# Altium project Rev5_FE_Test_Latched.PrjPCB
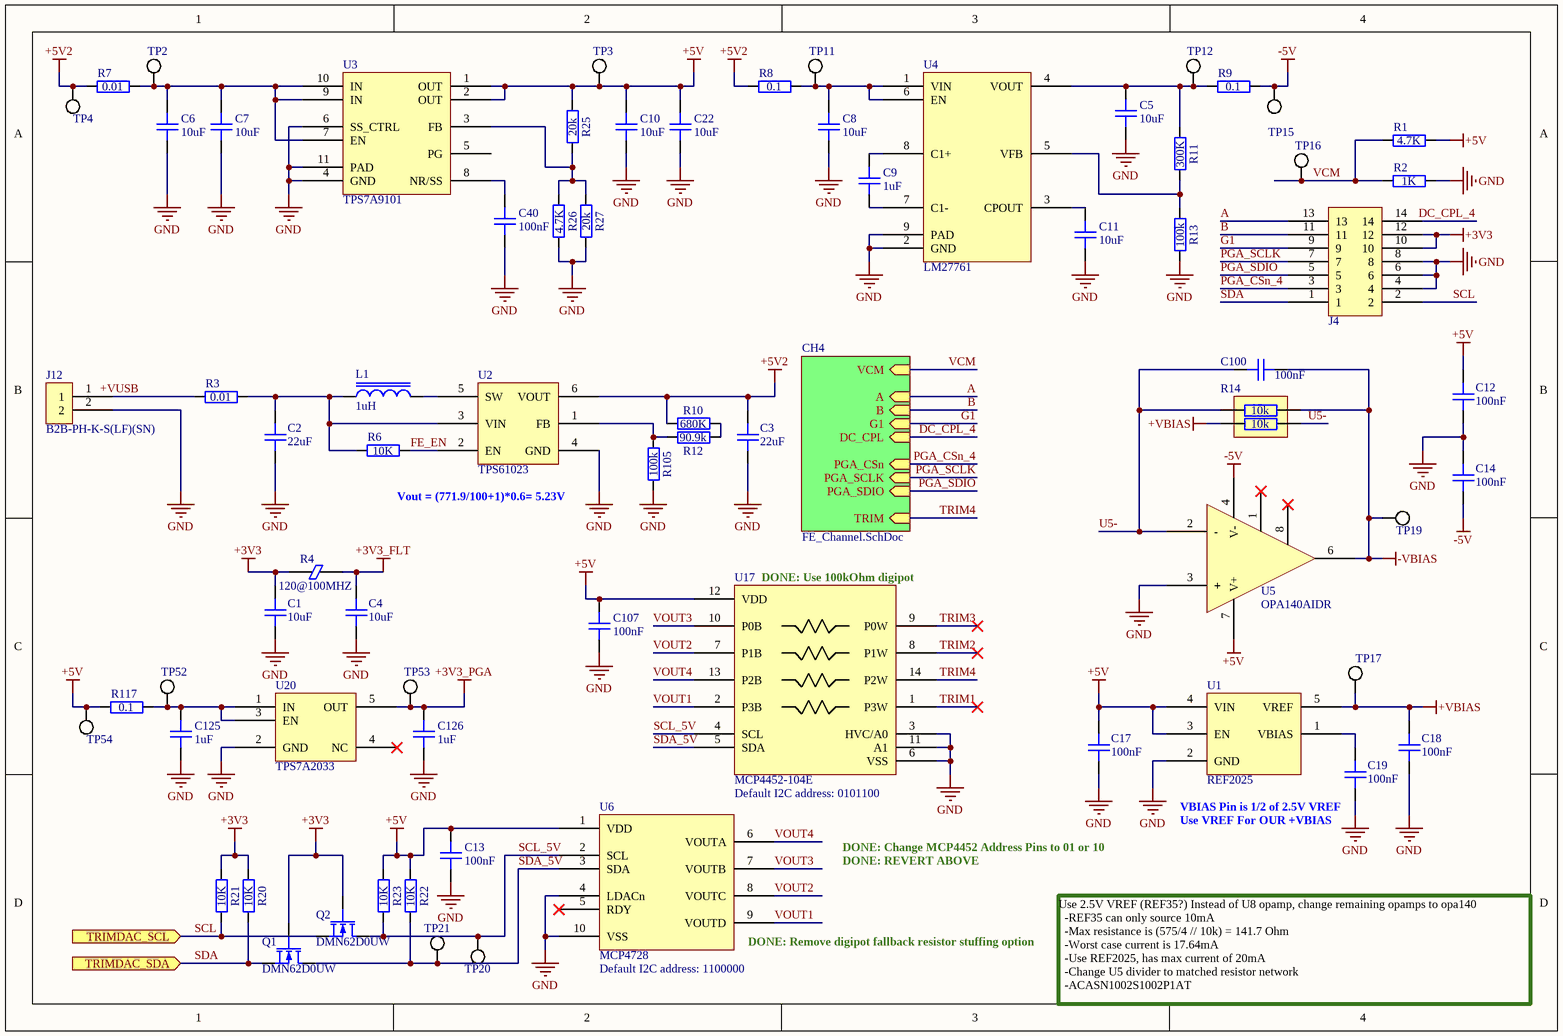
[diagram p0: FE.SchDoc]
Title: ThunderScope 1000E; Template Source URL: http://www.pcisig.com; Template Source Revision Date: R2.0, April 11, 2007; Template Source Organization: PCI-SIG; Template Source Document: Outline:PCI_Express_CEM_r2.0.pdf  Pinout:PCI_Express_CEM_r2.0.pdf; Template Revision Date: Oct 29, 2010; Template Notes: - Nominal values used, dimensions in mm  - The mounting holes and keep-out areas around them are only required when the I/O bracket is mounted on the card directly  - Component height rule and clearance rule derived from PCI_Express_CEM_r2.0.pdf, Page 84.  - Stackup is not specified in PCI_Express_CEM_r2.0.pdf, nor implemented in this template.
2 sheets, 161 parts. Net scope: hierarchical (ports join the sheet entries above them; power ports are global).
Board file: Rev5_FE_Test_Latched.PCBDOC
Sheets:
  FE.SchDoc
    CH4 = FE_Channel.SchDoc

## Sheet FE.SchDoc: ThunderScope 1000E
size A4; Revision: 1

### Parts
C1  10uF  [GEN_C_0603]
C2  22uF  [GEN_C_0805]
C3  22uF  [GEN_C_0805]
C4  10uF  [GEN_C_0603]
C5  10uF  [GEN_C_0603]
C6  10uF  [GEN_C_0603]
C7  10uF  [GEN_C_0603]
C8  10uF  [GEN_C_0603]
C9  1uF  [GEN_C_0402]
C10  10uF  [GEN_C_0603]
C11  10uF  [GEN_C_0603]
C12  100nF  [GEN_C_0402]
C13  100nF  [GEN_C_0402]
C14  100nF  [GEN_C_0402]
C17  100nF  [GEN_C_0402]
C18  100nF  [GEN_C_0402]
C19  100nF  [GEN_C_0402]
C22  10uF  [GEN_C_0603]
C40  100nF  [GEN_C_0402]
C100  100nF  [GEN_C_0402]
C107  100nF  [GEN_C_0402]
C125  1uF  [GEN_C_0402]
C126  1uF  [GEN_C_0402]
J4  2.54mm 2X7 Pin TH  [GEN_2.54mm_2X7_Pin_TH_RA]  (value not drawn)
J12  B2B-PH-K-S(LF)(SN)  [JST_B2B-PH-K-S(LF)(SN)]
L1  1uH  [GEN_L_1210]
Q1  DMN62D0UW  [GEN_SOT_323]
Q2  DMN62D0UW  [GEN_SOT_323]
R1  4.7K  [GEN_R_0402]
R2  1K  [GEN_R_0402]
R3  0.01  [GEN_R_0603]
R4  120@100MHZ  [GEN_R_0402]
R6  10K  [GEN_R_0402]
R7  0.01  [GEN_R_0603]
R8  0.1  [GEN_R_0402]
R9  0.1  [GEN_R_0402]
R10  680K  [GEN_R_0402]
R11  300K  [GEN_R_0402]
R12  90.9k  [GEN_R_0402]
R13  100k  [GEN_R_0402]
R14  10K  [GEN_R_2ARRAY_0606]  (value not drawn)
R20  10K  [GEN_R_0402]
R21  10K  [GEN_R_0402]
R22  10K  [GEN_R_0402]
R23  10K  [GEN_R_0402]
R25  20k  [GEN_R_0402]
R26  4.7K  [GEN_R_0402]
R27  20k  [GEN_R_0402]
R105  100k  [GEN_R_0402]
R117  0.1  [GEN_R_0402]
TP2  PCB  [GEN_TP_PCB]  (value not drawn)  (no BOM)
TP3  PCB  [GEN_TP_PCB]  (value not drawn)  (no BOM)
TP4  PCB  [GEN_TP_PCB]  (value not drawn)  (no BOM)
TP11  PCB  [GEN_TP_PCB]  (value not drawn)  (no BOM)
TP12  PCB  [GEN_TP_PCB]  (value not drawn)  (no BOM)
TP15  PCB  [GEN_TP_PCB]  (value not drawn)  (no BOM)
TP16  PCB  [GEN_TP_PCB]  (value not drawn)  (no BOM)
TP17  PCB  [GEN_TP_PCB]  (value not drawn)  (no BOM)
TP19  PCB  [GEN_TP_PCB]  (value not drawn)  (no BOM)
TP20  PCB  [GEN_TP_PCB]  (value not drawn)  (no BOM)
TP21  PCB  [GEN_TP_PCB]  (value not drawn)  (no BOM)
TP52  PCB  [GEN_TP_PCB]  (value not drawn)  (no BOM)
TP53  PCB  [GEN_TP_PCB]  (value not drawn)  (no BOM)
TP54  PCB  [GEN_TP_PCB]  (value not drawn)  (no BOM)
U1  REF2025  [GEN_SOT23_5_950_2900X1600X1450]
U2  TPS61023  [TI_SOT563_DRL0006A]
U3  TPS7A9101  [TI_WSON10_DSK0010A]
U4  LM27761  [TI_WSON8_DSG0008A]
U5  OPA140AIDR  [TI_SOIC8_D0008A]
U6  MCP4728  [MC_MSOP10_UN]
U17  MCP4452-104E  [MC_TSSOP14]
U20  TPS7A2033  [GEN_SOT23_5_950_2900X1600X1450]

### Sub-sheets
CH4 = FE_Channel.SchDoc: VCM (in), TRIM (in), B (in), DC_CPL (in), PGA_CSn (in), PGA_SCLK (in), PGA_SDIO (in), A (in), G1 (in)

### Ports
TRIMDAC_SCL (in), TRIMDAC_SDA (in)

### Nets
+3V3: C1.2 J4.10 J4.12 Q1.2(G) Q2.2(G) R4.1 R20.2 R21.2
+3V3_FLT: C4.2 R4.2
+3V3_PGA: C126.2 TP53.1 U20.5(OUT)
+5V: C10.2 C12.1 C13.2 C17.1 C22.2 C107.2 R1.2 R22.2 R23.2 R25.2 R117.1 TP3.1 TP54.1 U1.3(EN) U1.4(VIN) U3.1(OUT) U3.2(OUT) U5.7(V+) U6.1(VDD) U17.12(VDD)
+5V2: C3.2 R7.1 R8.1 R10.2 TP4.1 U2.6(VOUT)
+VBIAS: C18.1 R14.2 TP17.1 U1.5(VREF)
-5V: C14.2 R9.2 TP15.1 U5.4(V-)
-VBIAS: C100.1 R14.4 TP19.1 U5.6(OUT)
GND: C1.1 C2.1 C3.1 C4.1 C5.1 C6.1 C7.1 C8.1 C10.1 C11.1 C12.2 C13.1 C14.1 C17.2 C18.2 C19.1 C22.1 C40.1 C107.1 C125.1 C126.1 J4.4 J4.6 J4.8 J12.2 R2.2 R13.1 R26.1 R27.1 R105.1 U1.2(GND) U2.4(GND) U3.4(GND) U3.6(SS_CTRL) U3.11(PAD) U4.2(GND) U4.9(PAD) U5.3(+) U6.4(LDACn) U6.10(VSS) U17.3(HVC/A0) U17.6(VSS) U17.11(A1) U20.2(GND)
+VUSB: J12.1 R3.2
A: J4.13 ; sheet CH4/A
B: J4.11 ; sheet CH4/B
DC_CPL_4: J4.14 ; sheet CH4/DC_CPL
FE_EN: R6.1 U2.2(EN)
G1: J4.9 ; sheet CH4/G1
PGA_CSn_4: J4.3 ; sheet CH4/PGA_CSn
PGA_SCLK: J4.7 ; sheet CH4/PGA_SCLK
PGA_SDIO: J4.5 ; sheet CH4/PGA_SDIO
SCL: J4.2 Q2.3(S) R21.1 ; port TRIMDAC_SCL
SCL_5V: Q2.1(D) R23.1 TP20.1 U6.2(SCL) U17.4(SCL)
SDA: J4.1 Q1.3(S) R20.1 ; port TRIMDAC_SDA
SDA_5V: Q1.1(D) R22.1 TP21.1 U6.3(SDA) U17.5(SDA)
TRIM1: U17.1(P3W)
TRIM2: U17.8(P1W)
TRIM3: U17.9(P0W)
TRIM4: U17.14(P2W) ; sheet CH4/TRIM
U5-: C100.2 R14.1 R14.3 U5.2(-)
VCM: R1.1 R2.1 TP16.1 ; sheet CH4/VCM
VOUT1: U6.9(VOUTD) U17.2(P3B)
VOUT2: U6.8(VOUTC) U17.7(P1B)
VOUT3: U6.7(VOUTB) U17.10(P0B)
VOUT4: U6.6(VOUTA) U17.13(P2B)
NetC2_2: C2.2 L1.1 R3.1 R6.2 U2.3(VIN)
NetC5_2: C5.2 R9.1 R11.2 TP12.1 U4.4(VOUT)
NetC6_2: C6.2 C7.2 R7.2 TP2.1 U3.7(EN) U3.9(IN) U3.10(IN)
NetC8_2: C8.2 R8.2 TP11.1 U4.1(VIN) U4.6(EN)
NetC9_1: C9.1 U4.7(C1-)
NetC9_2: C9.2 U4.8(C1+)
NetC11_2: C11.2 U4.3(CPOUT)
NetC19_2: C19.2 U1.1(VBIAS)
NetC40_2: C40.2 U3.8(NR/SS)
NetC125_2: C125.2 R117.2 TP52.1 U20.1(IN) U20.3(EN)
NetL1_2: L1.2 U2.5(SW)
NetR10_1: R10.1 R12.2
NetR11_1: R11.1 R13.2 U4.5(VFB)
NetR12_1: R12.1 R105.2 U2.1(FB)
NetR25_1: R25.1 R26.2 R27.2 U3.3(FB)

Not connected (* = marked no-connect by the designer): U3 5(PG); U5 1(N1)* 8(N2)*; U6 5(RDY)*; U20 4(NC)*

### Notes on the sheet
- Vout = (771.9/100+1)*0.6= 5.23V
- (near U17) DONE: Use 100kOhm digipot
- Default I2C address: 0101100
- DONE: Change MCP4452 Address Pins to 01 or 10
- (near C19) VBIAS Pin is 1/2 of 2.5V VREF
- Use VREF For OUR +VBIAS
- DONE: REVERT ABOVE
- (near U6) Default I2C address: 1100000
- (near U6) DONE: Remove digipot fallback resistor stuffing option
- Use 2.5V VREF (REF35?) Instead of U8 opamp, change remaining opamps to opa140
  -REF35 can only source 10mA
  -Max resistance is (575/4 // 10k) = 141.7 Ohm
  -Worst case current is 17.64mA
  -Use REF2025, has max current of 20mA
  -Change U5 divider to matched resistor network
  -ACASN1002S1002P1AT
- Aleksa Bjelogrlic
- (in symbol RES ARRAY 2x 10K OHM 0.05% 0606) 10k

### Library data of the parts
C1 C4 = CAP 10uF 10V X5R 0603: Manufacturer: Murata; House Part Number: C-10uF-0603-002; Manufacturer Part Number: GRM188R61A106ME69D; Voltage Rating: 10V; Package: 0402; Value: 10uF; Supplier 1: Mouser; Supplier Part Number 1: 81-GRM188R61A106ME9D
C2 C3 = CAP 22uF 25V X5R 0805: House Part Number: C-22uF-0805-002; Manufacturer: Murata; Manufacturer Part Number: GRM21BR61E226ME44L; Voltage Rating: 25V; Package: 0805; Value: 22uF; Supplier 1: Mouser; Supplier Part Number 1: 81-GRM21BR61E226ME4L
C5-C8 C10 C11 C22 = CAP 10uF 10V X5R 0603: House Part Number: C-10uF-0603-002; Manufacturer: Murata; Manufacturer Part Number: GRM188R61A106ME69D; Voltage Rating: 10V; Package: 0402; Supplier 1: Mouser; Supplier Part Number 1: 81-GRM188R61A106ME9D; Value: 10uF
C9 C125 C126 = CAP 1uF 25V X5R 0402: Manufacturer: Murata; Manufacturer Part Number: GRM155R61E105KA12D; Voltage Rating: 25V; Package: 0402; Supplier 1: Mouser; Supplier Part Number 1: 81-GRM155R61E105KA2D; Value: 1uF
C12-C14 C17-C19 C100 C107 = CAP 100nF 16V X7R 0402: House Part Number: C-100nF-0402-002; Manufacturer: Murata; Manufacturer Part Number: GCM155R71C104KA55D; Voltage Rating: 16V; Package: 0402; Supplier 1: Mouser; Supplier Part Number 1: 81-GCM155R71C104KA5D; Value: 100nF
C40 = CAP 100nF 16V X7R 0402: Manufacturer: Murata; House Part Number: C-100nF-0402-002; Manufacturer Part Number: GCM155R71C104KA55D; Voltage Rating: 16V; Package: 0402; Supplier 1: Mouser; Supplier Part Number 1: 81-GCM155R71C104KA5D; Value: 100nF
J4 = CONN 2.54mm 2X7 Pin TH RA: Supplier 1: Digi-Key; Supplier Part Number 1: S9203-ND
J12 = CONN JST PH 2 Pin TH: Manufacturer: JST; Manufacturer Part Number: B2B-PH-K-S-LF-SN; Supplier 1: Digi-Key; Supplier Part Number 1: 455-1704-ND
L1 = IND 1uH 3.1A 45 MOHM 1210: Manufacturer: Murata; Manufacturer Part Number: 1277AS-H-1R0M=P2; Value: 1uH; Supplier 1: Mouser; Supplier Part Number 1: 81-1277AS-H-1R0MP2
Q1 Q2 = NMOS DMN62D0UW: House Part Number: DMN62D0UW-7; Manufacturer: Diodes; Vdss: 60V; Supplier 1: Mouser; Supplier Part Number 1: 621-DMN62D0UW-7; Manufacturer Part Number: DMN62D0UW-7
R1 R26 = RES 4.7K OHM 1% 1/10W 0402: Manufacturer: Panasonic; Manufacturer Part Number: ERJ-2RKF4701X; Tolerance: 1%; Package: 0402; Supplier 1: Mouser; Supplier Part Number 1: 667-ERJ-2RKF4701X; Value: 4.7K
R2 = RES 1K OHM 1% 1/10W 0402: Manufacturer: Yageo; House Part Number: R-1K-0402-1%-001; Manufacturer Part Number: RC0402FR-071KL; Tolerance: 1%; Package: 0402; Value: 1K; Supplier 1: Mouser; Supplier Part Number 1: 603-RC0402FR-071KL
R3 R7 = RES 0.01 OHM 1% 1/4W 0603: House Part Number: R-0.01-0603-1%-001; Manufacturer: Susumu; Manufacturer Part Number: RL0816T-R010-F; Tolerance: 1%; Supplier 1: Mouser; Supplier Part Number 1: 754-RL0816T-R010-F; Value: 0.01; Package: 0603
R4 = FERRITE BEAD 120 OHM 0402: Manufacturer: Murata; House Part Number: BLM15PX121SN1D; Manufacturer Part Number: BLM15PX121SN1D; Supplier 1: Mouser; Supplier Part Number 1: 81-BLM15PX121SN1D
R6 R20-R23 = RES 10K OHM 1% 1/10W 0402: Manufacturer: Panasonic; Manufacturer Part Number: ERJ-2RKF1002X; Tolerance: 1%; Package: 0402; Supplier 1: Mouser; Supplier Part Number 1: 667-ERJ-2RKF1002X; Value: 10K
R8 R9 R117 = RES 0.1 OHM 1% 1/6W 0402: Manufacturer: Panasonic; Manufacturer Part Number: ERJ-2BSFR10X; Tolerance: 1%; Package: 0402; Supplier 1: Mouser; Supplier Part Number 1: 667-ERJ-2BSFR10X; Value: 0.1
R10 = RES 680K OHM 1% 1/16W 0402: Manufacturer: Yageo; Manufacturer Part Number: RC0402FR-07681KL; Tolerance: 1%; Package: 0402; Supplier 1: Mouser; Supplier Part Number 1: 603-RC0402FR-07680KL; Value: 680K
R11 = RES 300K OHM 1% 1/10W 0402: Manufacturer: Panasonic; Manufacturer Part Number: ERJ-2RKF3003X; Tolerance: 1%; Package: 0402; Supplier 1: Mouser; Supplier Part Number 1: 667-ERJ-2RKF3003X; Value: 300K
R12 = RES 90.9K OHM 1% 1/16W 0402: Manufacturer: Yageo; Manufacturer Part Number: RC0402FR-0790K9L; Tolerance: 1%; Package: 0402; Supplier 1: Mouser; Supplier Part Number 1: 603-RC0402FR-0790K9L; Value: 90.9k
R13 R105 = RES 100K OHM 1% 1/10W 0402: House Part Number: R-100K-0402-1%-001; Manufacturer: Yageo; Manufacturer Part Number: RC0402FR-07100KL; Tolerance: 1%; Package: 0402; Supplier 1: Mouser; Supplier Part Number 1: 603-RC0402FR-07100KL; Value: 100k
R14 = RES ARRAY 2x 10K OHM 0.05% 0606: Manufacturer: Vishay Beyschlag; Manufacturer Part Number: ACASN1002S1002P1ATF1002X; Tolerance: 1%; Package: 0606; Value: 10K; Supplier 1: Mouser; Supplier Part Number 1: 594-ACASN1002S1002AT
R25 R27 = RES 20K OHM 1% 1/16W 0402: Manufacturer: Yageo; Manufacturer Part Number: RC0402FR-0720KL; Tolerance: 1%; Package: 0402; Supplier 1: Mouser; Supplier Part Number 1: 603-RC0402FR-0720KL; Value: 20k
TP2-TP4 TP11 TP12 TP15-TP17 TP19-TP21 TP52-TP54 = TP PCB 1mm
U1 = IC VREF REF2025: Supplier 1: Texas Instruments; Supplier Part Number 1: REF2025AIDDCR
U2 = IC BOOST TPS61023: Manufacturer: Texas Instruments; Manufacturer Part Number: TPS61023DRLT; Supplier 1: Texas Instruments; Supplier Part Number 1: TPS61023DRLT
U3 = IC LDO TPS7A9101: Supplier 1: Digi-Key; Supplier Part Number 1: 296-45298-1-ND
U4 = IC CPUMP LM27761: Manufacturer: Texas Instruments; Manufacturer Part Number: LM27761DSGR; Supplier 1: Texas Instruments; Supplier Part Number 1: LM27761DSGR
U5 = IC OPAMP OPA140: Manufacturer: Texas Instruments; Supplier 1: Texas Instruments; Supplier Part Number 1: OPA140AIDR; Manufacturer Part Number: OPA140AIDR
U6 = IC DAC QUAD MCP4728: Manufacturer: Microchip; Supplier 1: Mouser; Supplier Part Number 1: 579-MCP4728A1T-E/UN; Manufacturer Part Number: MCP4728
U17 = IC DIGIPOT QUAD MCP4452-104E: Manufacturer: Microchip; Supplier 1: Mouser; Supplier Part Number 1: 579-MCP4452-104E/ST; Manufacturer Part Number: MCP4452-104E
U20 = IC LDO TPS7A2033: Manufacturer: Texas Instruments; Manufacturer Part Number: TPS7A2033PDBVR; Supplier 1: Texas Instruments; Supplier Part Number 1: TPS7A2033PDBVR

## Sheet FE_Channel.SchDoc: ThunderScope 1000E
size A3; DrawnBy: Aleksa Bjelogrlic; Revision: 1
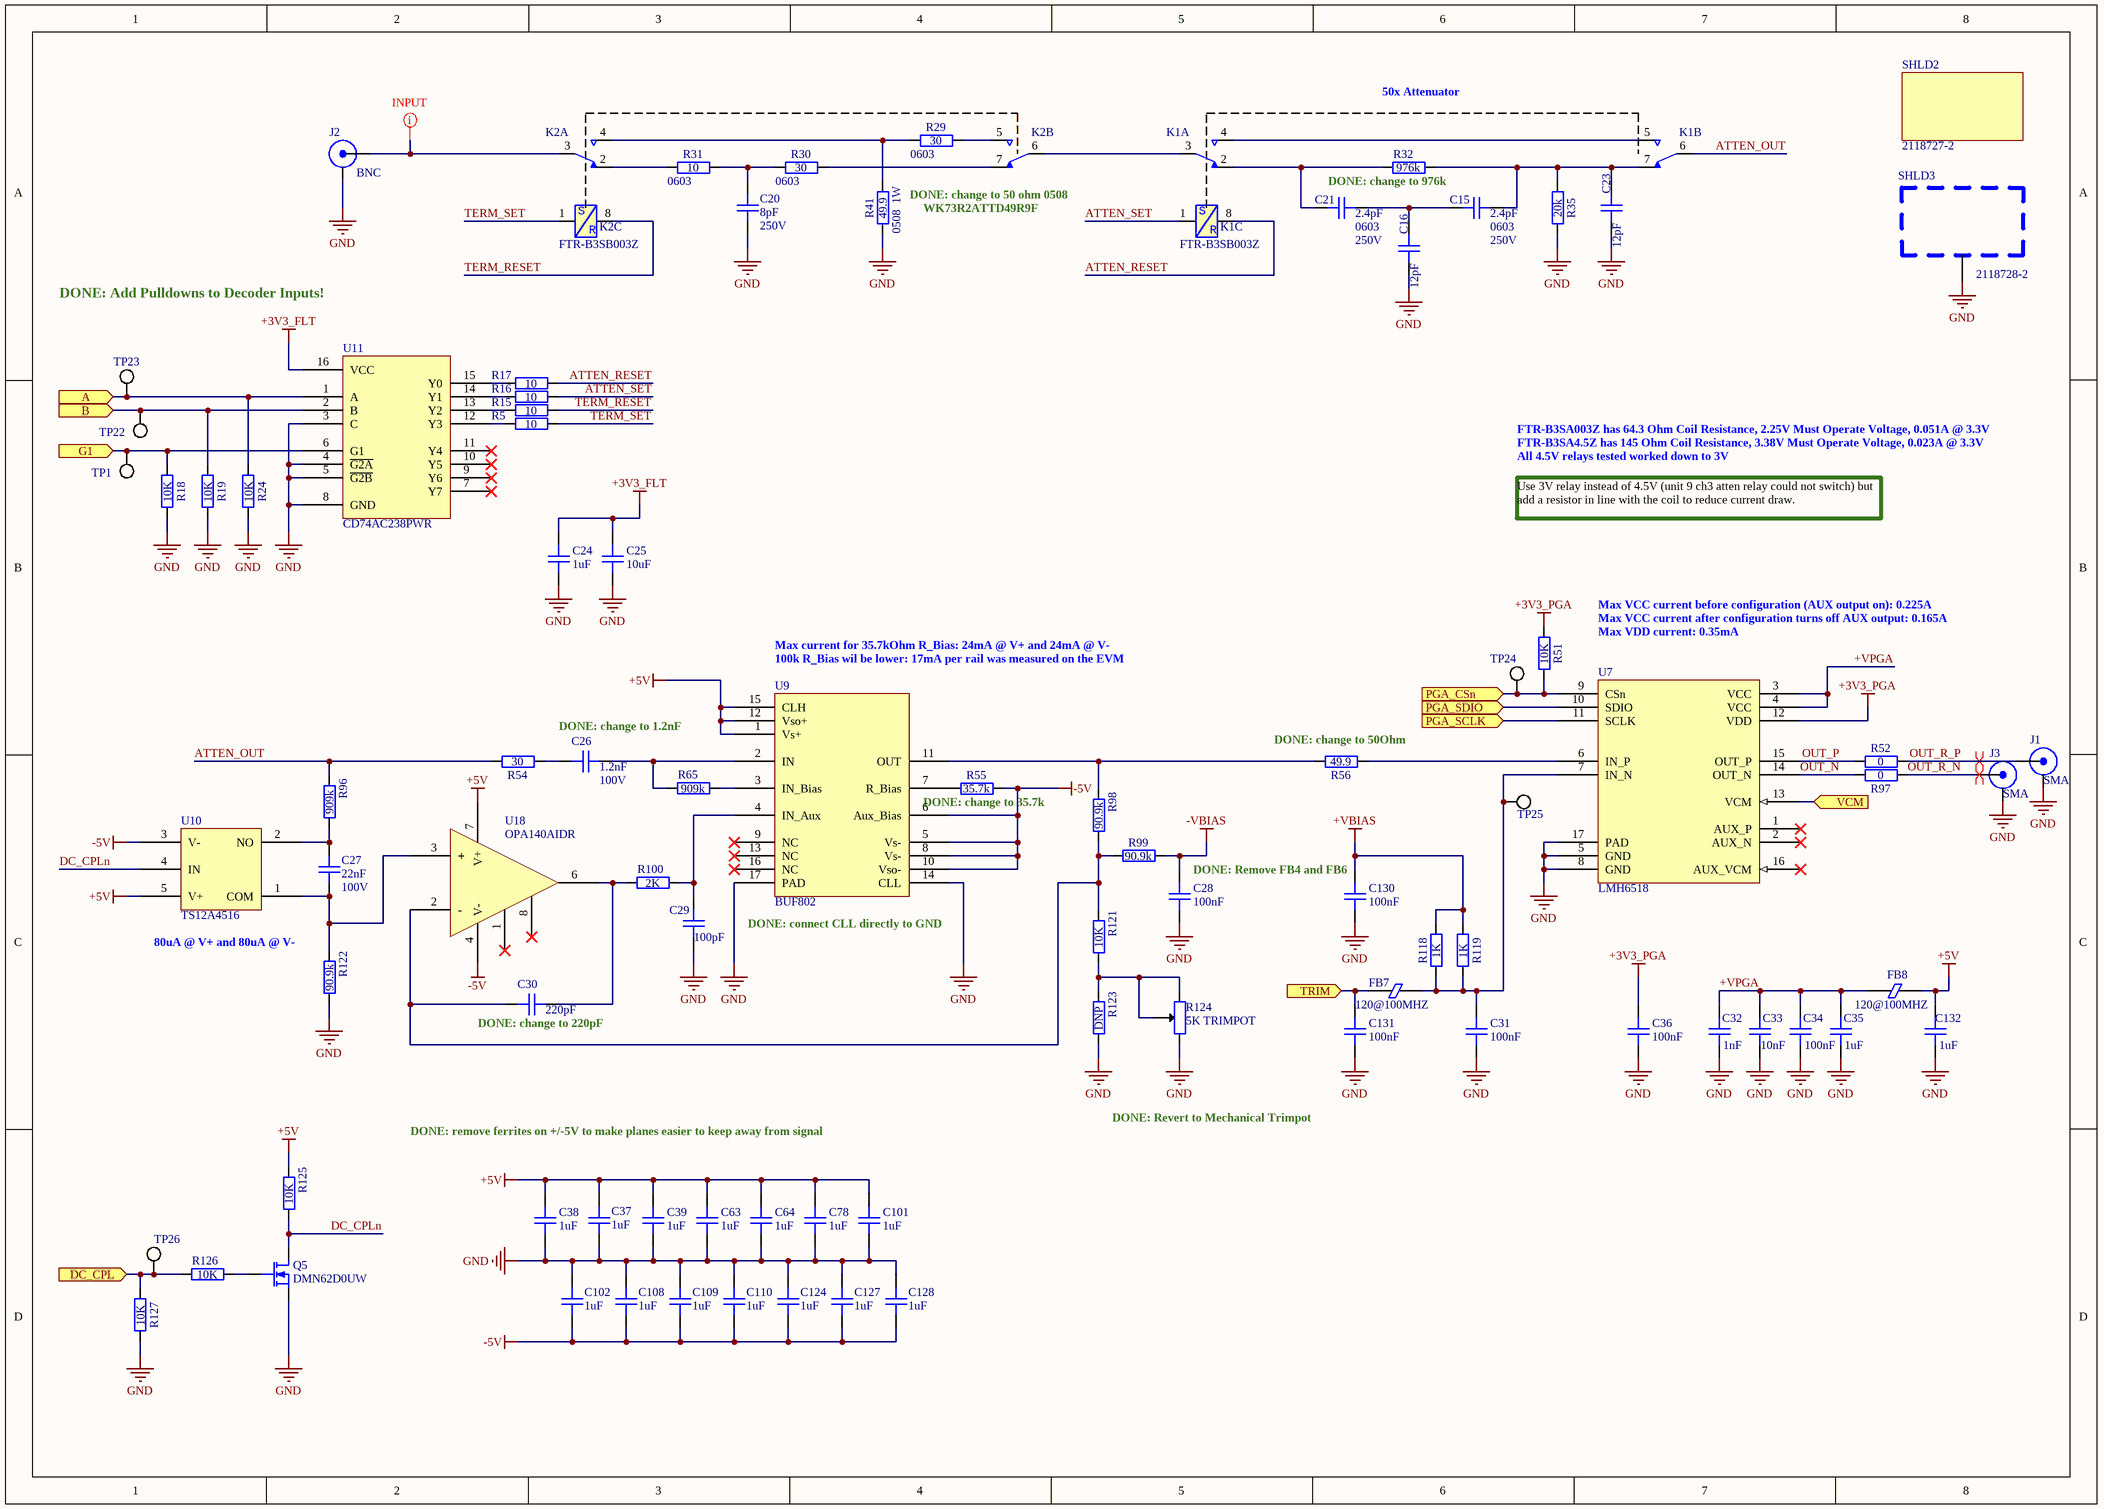
[diagram p1: FE_Channel.SchDoc]

### Parts
C15  2.4pF  Package: 0603  Voltage Rating: 250V  [GEN_C_0603]
C16  12pF  [GEN_C_0402]
C20  8pF  Voltage Rating: 250V  [GEN_C_0603]
C21  2.4pF  Package: 0603  Voltage Rating: 250V  [GEN_C_0603]
C23  12pF  [GEN_C_0402]
C24  1uF  [GEN_C_0402]
C25  10uF  [GEN_C_0603]
C26  1.2nF  Voltage Rating: 100V  [GEN_C_0603]
C27  22nF  Voltage Rating: 100V  [GEN_C_0603]
C28  100nF  [GEN_C_0402]
C29  100pF  [GEN_C_0402]
C30  220pF  [GEN_C_0402]
C31  100nF  [GEN_C_0402]
C32  1nF  [GEN_C_0402]
C33  10nF  [GEN_C_0402]
C34  100nF  [GEN_C_0402]
C35  1uF  [GEN_C_0402]
C36  100nF  [GEN_C_0402]
C37  1uF  [GEN_C_0402]
C38  1uF  [GEN_C_0402]
C39  1uF  [GEN_C_0402]
C63  1uF  [GEN_C_0402]
C64  1uF  [GEN_C_0402]
C78  1uF  [GEN_C_0402]
C101  1uF  [GEN_C_0402]
C102  1uF  [GEN_C_0402]
C108  1uF  [GEN_C_0402]
C109  1uF  [GEN_C_0402]
C110  1uF  [GEN_C_0402]
C124  1uF  [GEN_C_0402]
C127  1uF  [GEN_C_0402]
C128  1uF  [GEN_C_0402]
C130  100nF  [GEN_C_0402]
C131  100nF  [GEN_C_0402]
C132  1uF  [GEN_C_0402]
FB7  120@100MHZ  [GEN_R_0402]
FB8  120@100MHZ  [GEN_R_0402]
J1  SMA  [MOL_0733910083]
J2  BNC  [MOL_0731000105]
J3  SMA  [MOL_0733910083]
K1  FTR-B3SB003Z  [FUJ_FTR-B3SA]  (value not drawn)  (parts A,B,C of 3)
K2  FTR-B3SB003Z  [FUJ_FTR-B3SA]  (value not drawn)  (parts A,B,C of 3)
Q5  DMN62D0UW  [GEN_SOT_323]
R5  10  [GEN_R_0603]
R15  10  [GEN_R_0603]
R16  10  [GEN_R_0603]
R17  10  [GEN_R_0603]
R18  10K  [GEN_R_0402]
R19  10K  [GEN_R_0402]
R24  10K  [GEN_R_0402]
R29  30  Package: 0603  [GEN_R_0603]
R30  30  Package: 0603  [GEN_R_0603]
R31  10  Package: 0603  [GEN_R_0603]
R32  976k  [GEN_R_0603]
R35  20k  [GEN_R_0402]
R41  49.9  Package: 0508  Power Rating: 1W  [GEN_R_0508]
R51  10K  [GEN_R_0402]
R52  0  [GEN_R_0402]
R54  30  [GEN_R_0603]
R55  35.7k  [GEN_R_0402]
R56  49.9  [GEN_R_0402]
R65  909k  [GEN_R_0402]
R96  909k  [GEN_R_0402]
R97  0  [GEN_R_0402]
R98  90.9k  [GEN_R_0402]
R99  90.9k  [GEN_R_0402]
R100  2K  [GEN_R_0402]
R118  1K  [GEN_R_0402]
R119  1K  [GEN_R_0402]
R121  10K  [GEN_R_0402]
R122  90.9k  [GEN_R_0402]
R123  DNP  [GEN_R_0402]  (no BOM)
R124  5K TRIMPOT  [BOU_3mm_POT]
R125  10K  [GEN_R_0402]
R126  10K  [GEN_R_0402]
R127  10K  [GEN_R_0402]
SHLD2  2118727-2  (mechanical)
SHLD3  2118728-2  [TE_2118728-2]
TP1  PCB  [GEN_TP_PCB]  (value not drawn)  (no BOM)
TP22  PCB  [GEN_TP_PCB]  (value not drawn)  (no BOM)
TP23  PCB  [GEN_TP_PCB]  (value not drawn)  (no BOM)
TP24  PCB  [GEN_TP_PCB]  (value not drawn)  (no BOM)
TP25  PCB  [GEN_TP_PCB]  (value not drawn)  (no BOM)
TP26  PCB  [GEN_TP_PCB]  (value not drawn)  (no BOM)
U7  LMH6518  [TI_WQFN_RGH0016A]
U9  BUF802  [TI_VQFN_RGT0016C]
U10  TS12A4516  [GEN_SOT23_5_950_2900X1600X1450]
U11  CD74AC238PWR  [TI_TSSOP16_PW0016A]
U18  OPA140AIDR  [TI_SOIC8_D0008A]

### Ports
A (in), B (in), DC_CPL (in), G1 (in), PGA_CSn (in), PGA_SCLK (in), PGA_SDIO (in), TRIM (in), VCM (in)

### Nets
+3V3_FLT: C24.2 C25.2 U11.16(VCC)
+3V3_PGA: C36.2 R51.2 U7.12(VDD)
+5V: C37.2 C38.1 C39.1 C63.1 C64.2 C78.2 C101.2 C132.2 FB8.2 R125.2 U9.1(Vs+) U9.12(Vso+) U9.15(CLH) U10.5(V+) U18.7(V+)
+VBIAS: C130.1 R118.2 R119.1
-5V: C102.2 C108.2 C109.1 C110.1 C124.1 C127.2 C128.2 R55.2 U9.5(Vs-) U9.6(Aux_Bias) U9.8(Vs-) U9.10(Vso-) U10.3(V-) U18.4(V-)
-VBIAS: C28.1 R99.1
GND: C16.1 C20.2 C23.1 C24.1 C25.1 C28.2 C29.1 C31.2 C32.1 C33.1 C34.1 C35.1 C36.1 C37.1 C38.2 C39.2 C63.2 C64.1 C78.1 C101.1 C102.1 C108.1 C109.2 C110.2 C124.2 C127.1 C128.1 C130.2 C131.2 C132.1 J1.2(SHIELD) J2.2(SHIELD) J3.2(SHIELD) Q5.3(S) R18.1 R19.1 R24.1 R35.1 R41.1 R122.1 R123.1 R124.3 R127.1 SHLD3.1 U7.5(GND) U7.8(GND) U7.17(PAD) U9.14(CLL) U9.17(PAD) U11.3(C) U11.4(~{G2A}) U11.5(~{G2B}) U11.8(GND)
+VPGA: C32.2 C33.2 C34.2 C35.2 FB8.1 U7.3(VCC) U7.4(VCC)
A: R24.2 TP23.1 U11.1(A) ; port A
ATTEN_OUT: K1.6 R54.1 R96.2
ATTEN_RESET: K1.8 R17.2
ATTEN_SET: K1.1 R16.2
B: R19.2 TP22.1 U11.2(B) ; port B
DC_CPL_4: R126.2 R127.2 TP26.1 ; port DC_CPL
DC_CPLn: Q5.1(D) R125.1 U10.4(IN)
G1: R18.2 TP1.1 U11.6(G1) ; port G1
OUT_N: R97.1 U7.14(OUT_N)
OUT_P: R52.1 U7.15(OUT_P)
OUT_R_N: J3.1(Signal) R97.2
OUT_R_P: J1.1(Signal) R52.2
PGA_CSn_4: R51.1 TP24.1 U7.9(CSn) ; port PGA_CSn
PGA_SCLK: U7.11(SCLK) ; port PGA_SCLK
PGA_SDIO: U7.10(SDIO) ; port PGA_SDIO
TERM_RESET: K2.8 R15.2
TERM_SET: K2.1 R5.2
TRIM4: C131.1 FB7.1 ; port TRIM
VCM: U7.13(VCM) ; port VCM
NetC15_1: C15.1 C23.2 K1.7 R32.2 R35.2
NetC15_2: C15.2 C16.2 C21.1
NetC20_1: C20.1 R30.1 R31.2
NetC21_2: C21.2 K1.2 R32.1
NetC26_1: C26.1 R65.2 U9.2(IN)
NetC26_2: C26.2 R54.2
NetC27_1: C27.1 R96.1 U10.2(NO)
NetC27_2: C27.2 R122.2 U10.1(COM) U18.3(+)
NetC29_2: C29.2 R100.1 U9.4(IN_Aux)
NetC30_1: C30.1 R100.2 U18.6(OUT)
NetC30_2: C30.2 R98.1 R99.2 R121.2 U18.2(-)
NetC31_1: C31.1 FB7.2 R118.1 R119.2 TP25.1 U7.7(IN_N)
NetJ2_1: J2.1(Signal) K2.3
NetK1_3: K1.3 K2.6
NetK1_4: K1.4 K1.5
NetK2_2: K2.2 R31.1
NetK2_4: K2.4 R29.1 R41.2
NetK2_5: K2.5 R29.2
NetK2_7: K2.7 R30.2
NetQ5_2: Q5.2(G) R126.1
NetR5_1: R5.1 U11.12(Y3)
NetR15_1: R15.1 U11.13(Y2)
NetR16_1: R16.1 U11.14(Y1)
NetR17_1: R17.1 U11.15(Y0)
NetR55_1: R55.1 U9.7(R_Bias)
NetR56_1: R56.1 R98.2 U9.11(OUT)
NetR56_2: R56.2 U7.6(IN_P)
NetR65_1: R65.1 U9.3(IN_Bias)
NetR121_1: R121.1 R123.2 R124.1 R124.2

Not connected (* = marked no-connect by the designer): U7 1(AUX_P)* 2(AUX_N)* 16(AUX_VCM)*; U9 9(NC)* 13(NC)* 16(NC)*; U11 7(Y7)* 9(Y6)* 10(Y5)* 11(Y4)*; U18 1(N1)* 8(N2)*

### Layout directives
differential pair; differential pair class 100Z: OUT_R_N, OUT_R_P
net class INPUT: NetJ2_1

### Notes on the sheet
- 50x Attenuator
- (near R32) DONE: change to 976k
- DONE: change to 50 ohm 0508
- WK73R2ATTD49R9F
- DONE: Add Pulldowns to Decoder Inputs!
- FTR-B3SA003Z has 64.3 Ohm Coil Resistance, 2.25V Must Operate Voltage, 0.051A @ 3.3V
- FTR-B3SA4.5Z has 145 Ohm Coil Resistance, 3.38V Must Operate Voltage, 0.023A @ 3.3V
- All 4.5V relays tested worked down to 3V
- Use 3V relay instead of 4.5V (unit 9 ch3 atten relay could not switch) but add a resistor in line with the coil to reduce current draw.
- Max current for 35.7kOhm R_Bias: 24mA @ V+ and 24mA @ V-
- Max VCC current before configuration (AUX output on): 0.225A
- Max VCC current after configuration turns off AUX output: 0.165A
- Max VDD current: 0.35mA
- (near U9) 100k R_Bias wil be lower: 17mA per rail was measured on the EVM
- DONE: change to 1.2nF
- (near R56) DONE: change to 50Ohm
- DONE: change to 35.7k
- DONE: connect CLL directly to GND
- DONE: Remove FB4 and FB6
- 80uA @ V+ and 80uA @ V-
- (near C30) DONE: change to 220pF
- DONE: Revert to Mechanical Trimpot
- DONE: remove ferrites on +/-5V to make planes easier to keep away from signal
- (in symbol RELAY DPDT-NO FTR-B3SB003Z, part C) S; R

### Library data of the parts
C15 C21 = CAP 2.4pF 250V C0G 0603: Manufacturer: KEMET; Manufacturer Part Number: CBR06C249BAGAC; Supplier 1: Mouser; Supplier Part Number 1: 80-CBR06C249BAGAC; Value: 2.4pF
C16 C23 = CAP 12pF 50V C0G 0402: Manufacturer: KEMET; Manufacturer Part Number: CBR04C120F5GAC; Voltage Rating: 50V; Temperature Coefficient: C0G; Package: 0402; Supplier 1: Mouser; Supplier Part Number 1: 80-CBR04C120F5G; Value: 12pF
C20 = CAP 8pF 250V C0G 0603: Manufacturer: KEMET; Manufacturer Part Number: CBR06C809BAGAC; Value: 8pF; Supplier 1: Mouser; Supplier Part Number 1: 80-CBR06C809BAGAC; Package: 0603
C24 C35 C37-C39 C63 C64 C78 C101 C102 C108-C110 C124 C127 C128 C132 = CAP 1uF 25V X5R 0402: as C9 on sheet FE; Package: 0402; Supplier 1: Mouser; Supplier Part Number 1: 81-GRM155R61E105KA2D; Value: 1uF
C25 = CAP 10uF 10V X5R 0603: as C5 on sheet FE; Package: 0402; Supplier 1: Mouser; Supplier Part Number 1: 81-GRM188R61A106ME9D; Value: 10uF
C26 = CAP 1.2nF 100V C0G 0603: Manufacturer: Murata; Manufacturer Part Number: GCM1885C2A122FA16D; Temperature Coefficient: C0G; Package: 0603; Value: 1.2nF; Supplier 1: Mouser; Supplier Part Number 1: 81-GCM1885C2A122FA6D
C27 = CAP 22nF 100V X7R 0603: Manufacturer: Murata; Manufacturer Part Number: GCM188R72A223KA37D; Package: 0603; Value: 22nF; Supplier 1: Mouser; Supplier Part Number 1: 81-GCM188R72A223KA7D
C28 C31 C34 C36 C130 C131 = CAP 100nF 16V X7R 0402: as C12 on sheet FE; Package: 0402; Supplier 1: Mouser; Supplier Part Number 1: 81-GCM155R71C104KA5D; Value: 100nF
C29 = CAP 100pF 50V C0G 0402: Manufacturer: Murata; Manufacturer Part Number: GCM1555C1H101FA16D; Temperature Coefficient: C0G; Voltage Rating: 50V; Package: 0402; Value: 100pF; Supplier 1: Mouser; Supplier Part Number 1: 81-GCM1555C1H101FA6D
C30 = CAP 220pF 50V C0G 0402: Manufacturer: Murata; Manufacturer Part Number: GCM1555C1H221FA16J; Temperature Coefficient: C0G; Voltage Rating: 50V; Package: 0402; Value: 220pF; Supplier 1: Mouser; Supplier Part Number 1: 81-GCM1555C1H221FA6J
C32 = CAP 1nF 50V C0G 0402: Manufacturer: Murata; Manufacturer Part Number: GRM1555C1H102FA01D; Voltage Rating: 50V; Package: 0402; Supplier 1: Mouser; Supplier Part Number 1: 81-GRM1555C1H102FA1D; Value: 1nF
C33 = CAP 10nF 50V X7R 0402: House Part Number: C-10nF-0402-002; Manufacturer: Murata; Manufacturer Part Number: GRM155R71H103KA88J; Voltage Rating: 50V; Package: 0402; Supplier 1: Mouser; Supplier Part Number 1: 81-GRM155R71H103KA8J; Value: 10nF
FB7 FB8 = FERRITE BEAD 120 OHM 0402: House Part Number: BLM15PX121SN1D; Manufacturer: Murata; Supplier 1: Mouser; Supplier Part Number 1: 81-BLM15PX121SN1D; Manufacturer Part Number: BLM15PX121SN1D
J1 J3 = SMA JACK R/A: Manufacturer: Molex; Manufacturer Part Number: 73100-0105; Supplier 1: Digi-Key; Supplier Part Number 1: WM26450-ND
J2 = BNC JACK R/A: Manufacturer: Molex; Manufacturer Part Number: 73100-0105; Supplier 1: Mouser; Supplier Part Number 1: 538-73100-0105
K1 K2 = RELAY DPDT-NO FTR-B3SB003Z: Manufacturer: Fujitsu; Manufacturer Part Number: FTR-B3SB003Z
Q5 = NMOS DMN62D0UW: as Q1 on sheet FE; Supplier 1: Mouser; Supplier Part Number 1: 621-DMN62D0UW-7; Manufacturer Part Number: DMN62D0UW-7
R5 R15-R17 R31 = RES 10 OHM 1% 1/3W 0603: Manufacturer: KOA Speer; Manufacturer Part Number: SG73P1JTTD10R0F; Tolerance: 1%; Value: 10; Supplier 1: Mouser; Supplier Part Number 1: 660-SG73P1JTTD10R0F
  R5 R15-R17: Package: 0603
R18 R19 R24 R51 R121 R125-R127 = RES 10K OHM 1% 1/10W 0402: as R6 on sheet FE; Package: 0402; Supplier 1: Mouser; Supplier Part Number 1: 667-ERJ-2RKF1002X; Value: 10K
R29 R30 R54 = RES 30 OHM 1% 1/3W 0603: Manufacturer: KOA Speer; Manufacturer Part Number: SG73P1JTTD30R0F; Tolerance: 1%; Value: 30; Supplier 1: Mouser; Supplier Part Number 1: 660-SG73P1JTTD30R0F
  R54: Package: 0603
R32 = RES 976k OHM 1% 1/10W 0603: Manufacturer: KOA Speer; Manufacturer Part Number: RK73H1JTTD9763F; Tolerance: 1%; Package: 0603; Value: 976k; Supplier 1: Mouser; Supplier Part Number 1: 660-RK73H1JTTD9763F
R35 = RES 20K OHM 1% 1/16W 0402: as R25 on sheet FE; Package: 0402; Supplier 1: Mouser; Supplier Part Number 1: 603-RC0402FR-0720KL; Value: 20k
R41 = RES 49.9 OHM 1% 1W 0508: Manufacturer: KOA Speer; Manufacturer Part Number: WK73R2ATTD49R9F; Tolerance: 1%; Value: 49.9; Supplier 1: Mouser; Supplier Part Number 1: 660-WK73R2ATTD49R9F
R52 R97 = RES 0 OHM 1/16W 0402: Manufacturer: Yageo; Manufacturer Part Number: RC0402JR-070RL; Package: 0402; Supplier 1: Mouser; Supplier Part Number 1: 603-RC0402JR-070RL; Value: 0
R55 = RES 35.7K OHM 1% 1/16W 0402: Manufacturer: Yageo; Manufacturer Part Number: RC0402FR-0735K7L; Tolerance: 1%; Package: 0402; Value: 35.7k; Supplier 1: Mouser; Supplier Part Number 1: 603-RC0402FR-0735K7L
R56 = RES 49.9 OHM 1% 1/10W 0402: Manufacturer: Yageo; Manufacturer Part Number: RC0402FR-0749R9L; Tolerance: 1%; Package: 0402; Value: 49.9; Supplier 1: Mouser; Supplier Part Number 1: 603-RC0402FR-0749R9L
R65 R96 = RES 909K OHM 1% 1/16W 0402: Manufacturer: Yageo; Manufacturer Part Number: RC0402FR-07909KL; Tolerance: 1%; Package: 0402; Supplier 1: Mouser; Supplier Part Number 1: 603-RC0402FR-07909KL; Value: 909k
R98 R99 R122 = RES 90.9K OHM 1% 1/16W 0402: as R12 on sheet FE; Package: 0402; Supplier 1: Mouser; Supplier Part Number 1: 603-RC0402FR-0790K9L; Value: 90.9k
R100 = RES 2K OHM 1% 1/16W 0402: Manufacturer: Yageo; Manufacturer Part Number: RC0402FR-072KL; Tolerance: 1%; Package: 0402; Supplier 1: Mouser; Supplier Part Number 1: 603-RC0402FR-072KL; Value: 2K
R118 R119 = RES 1K OHM 1% 1/10W 0402: House Part Number: R-1K-0402-1%-001; Manufacturer: Yageo; Manufacturer Part Number: RC0402FR-071KL; Tolerance: 1%; Package: 0402; Supplier 1: Mouser; Supplier Part Number 1: 603-RC0402FR-071KL; Value: 1K
R123 = RES DNP 0402: Tolerance: 1%; Package: 0402; Value: DNP
R124 = TRIMMER 5K OHM 0.1W J LEAD TOP: Manufacturer: Bourns; Manufacturer Part Number: TC33X-2-502E; Tolerance: 1%; Supplier 1: Mouser; Supplier Part Number 1: 652-TC33X-2-502E; Value: 5K
SHLD2 = SHIELD 2118727-2: Manufacturer: TE Connectivity AMP; Supplier 1: Mouser; Supplier Part Number 1: 571-2118727-2; Manufacturer Part Number: 2118727-2
SHLD3 = SHIELD 2118728-2: Manufacturer: TE Connectivity; Supplier 1: Mouser; Supplier Part Number 1: 571-2118728-2; Manufacturer Part Number: 2118728-2
TP1 TP22-TP26 = TP PCB 1mm
U7 = IC PGA LMH6518: Manufacturer: Texas Instruments; Manufacturer Part Number: LMH6518SQE/NOPB; Supplier 1: Texas Instruments; Supplier Part Number 1: LMH6518SQX/NOPB
U9 = IC BUFFER AMP BUF802: Manufacturer: Texas Instruments; Manufacturer Part Number: BUF802IRGTR; Supplier 1: Texas Instruments; Supplier Part Number 1: BUF802IRGTR
U10 = IC SWITCH SPST TS12A4516DBVR: Manufacturer: Texas Instruments; Supplier 1: Texas Instruments; Supplier Part Number 1: TS12A4516DBVR; Manufacturer Part Number: TS12A4516DBVR
U11 = IC DECODER CD74AC238: Manufacturer: Texas Instruments; House Part Number: CD74AC238PWR; Manufacturer Part Number: CD74AC238PWR; Supplier 1: Mouser; Supplier Part Number 1: 595-CD74AC238PWR
U18 = IC OPAMP OPA140: Manufacturer: Texas Instruments; Supplier 1: Texas Instruments; Supplier Part Number 1: OPA140AIDR; Manufacturer Part Number: OPA140AIDR

## Nets that join several sheets
+3V3_FLT: FE (C4.2 R4.2), FE_Channel (C24.2 C25.2 U11.16)
+3V3_PGA: FE (C126.2 TP53.1 U20.5), FE_Channel (C36.2 R51.2 U7.12)
+5V: FE (20 pins), FE_Channel (15 pins)
+VBIAS: FE (C18.1 R14.2 TP17.1 U1.5), FE_Channel (C130.1 R118.2 R119.1)
-5V: FE (C14.2 R9.2 TP15.1 U5.4), FE_Channel (14 pins)
-VBIAS: FE (C100.1 R14.4 TP19.1 U5.6), FE_Channel (C28.1 R99.1)
GND: FE (44 pins), FE_Channel (53 pins)
A: FE (J4.13), FE_Channel (R24.2 TP23.1 U11.1)
B: FE (J4.11), FE_Channel (R19.2 TP22.1 U11.2)
DC_CPL_4: FE (J4.14), FE_Channel (R126.2 R127.2 TP26.1)
G1: FE (J4.9), FE_Channel (R18.2 TP1.1 U11.6)
PGA_CSn_4: FE (J4.3), FE_Channel (R51.1 TP24.1 U7.9)
PGA_SCLK: FE (J4.7), FE_Channel (U7.11)
PGA_SDIO: FE (J4.5), FE_Channel (U7.10)
TRIM4: FE (U17.14), FE_Channel (C131.1 FB7.1)
VCM: FE (R1.1 R2.1 TP16.1), FE_Channel (U7.13)